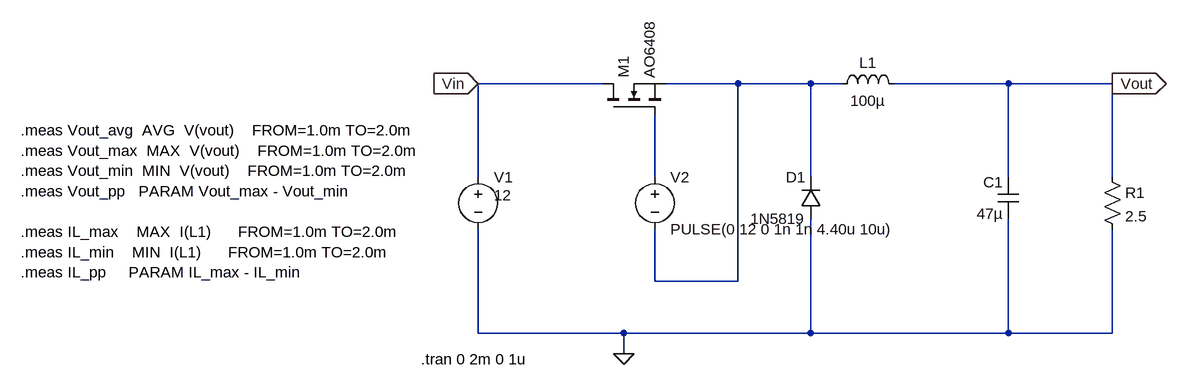
[diagram p0: schematic buck_converter_ltspice.asc]
buck_converter_ltspice.asc, the LTspice schematic file:
Version 4.1
SHEET 1 896 680
WIRE 0 48 -192 48
WIRE 208 48 96 48
WIRE 320 48 208 48
WIRE 368 48 320 48
WIRE 624 48 448 48
WIRE 784 48 624 48
WIRE -192 192 -192 48
WIRE 80 192 80 96
WIRE 320 192 320 48
WIRE 624 192 624 48
WIRE 784 192 784 48
WIRE 80 352 80 272
WIRE 208 352 208 48
WIRE 208 352 80 352
WIRE -192 432 -192 272
WIRE 32 432 -192 432
WIRE 320 432 320 256
WIRE 320 432 32 432
WIRE 624 432 624 256
WIRE 624 432 320 432
WIRE 784 432 784 272
WIRE 784 432 624 432
WIRE 32 464 32 432
FLAG -192 48 Vin
IOPIN -192 48 In
FLAG 784 48 Vout
IOPIN 784 48 Out
FLAG 32 464 0
SYMBOL voltage -192 176 R0
WINDOW 3 24 44 Left 2
WINDOW 123 0 0 Left 0
WINDOW 39 0 0 Left 0
SYMATTR Value 12
SYMATTR InstName V1
SYMBOL nmos 0 96 R270
SYMATTR InstName M1
SYMATTR Value AO6408
SYMBOL ind 352 64 R270
WINDOW 0 32 56 VTop 2
WINDOW 3 5 56 VBottom 2
SYMATTR InstName L1
SYMATTR Value 100µ
SYMATTR SpiceLine Rser=0 Rpar=0
SYMBOL cap 640 256 R180
WINDOW 0 24 56 Left 2
WINDOW 3 24 8 Left 2
SYMATTR InstName C1
SYMATTR Value 47µ
SYMATTR SpiceLine Rser=0.05 Rpar=1Meg
SYMBOL res 768 176 R0
SYMATTR InstName R1
SYMATTR Value 2.5
SYMATTR SpiceLine pwr=10
SYMBOL diode 336 256 R180
WINDOW 0 24 64 Left 2
WINDOW 3 24 0 Left 2
SYMATTR InstName D1
SYMATTR Value 1N5819
SYMBOL voltage 80 176 R0
WINDOW 123 0 0 Left 0
WINDOW 39 0 0 Left 0
SYMATTR InstName V2
SYMATTR Value PULSE(0 12 0 1n 1n 4.40u 10u)
TEXT -280 472 Left 2 !.tran 0 2m 0 1u
TEXT -896 120 Left 2 !.meas Vout_avg  AVG  V(vout)    FROM=1.0m TO=2.0m\n.meas Vout_max  MAX  V(vout)    FROM=1.0m TO=2.0m\n.meas Vout_min  MIN  V(vout)    FROM=1.0m TO=2.0m\n.meas Vout_pp   PARAM Vout_max - Vout_min\n \n.meas IL_max    MAX  I(L1)      FROM=1.0m TO=2.0m\n.meas IL_min    MIN  I(L1)      FROM=1.0m TO=2.0m\n.meas IL_pp     PARAM IL_max - IL_min

The netlist it stands for:
* buck_converter_ltspice.asc
V1 Vin 0 12
M1 Vin N002 N001 N001 AO6408
L1 N001 Vout 100µ Rser=0 Rpar=0
C1 0 Vout 47µ Rser=0.05 Rpar=1Meg
R1 Vout 0 2.5 pwr=10
D1 0 N001 1N5819
V2 N002 N001 PULSE(0 12 0 1n 1n 4.40u 10u)
.model D D
.lib standard.dio
.model NMOS NMOS
.model PMOS PMOS
.lib standard.mos
.tran 0 2m 0 1u
.meas Vout_avg  AVG  V(vout)    FROM=1.0m TO=2.0m
.meas Vout_max  MAX  V(vout)    FROM=1.0m TO=2.0m
.meas Vout_min  MIN  V(vout)    FROM=1.0m TO=2.0m
.meas Vout_pp   PARAM Vout_max - Vout_min
.meas IL_max    MAX  I(L1)      FROM=1.0m TO=2.0m
.meas IL_min    MIN  I(L1)      FROM=1.0m TO=2.0m
.meas IL_pp     PARAM IL_max - IL_min
.backanno
.end